# Altium schematic sheet camera.SchDoc
size A3
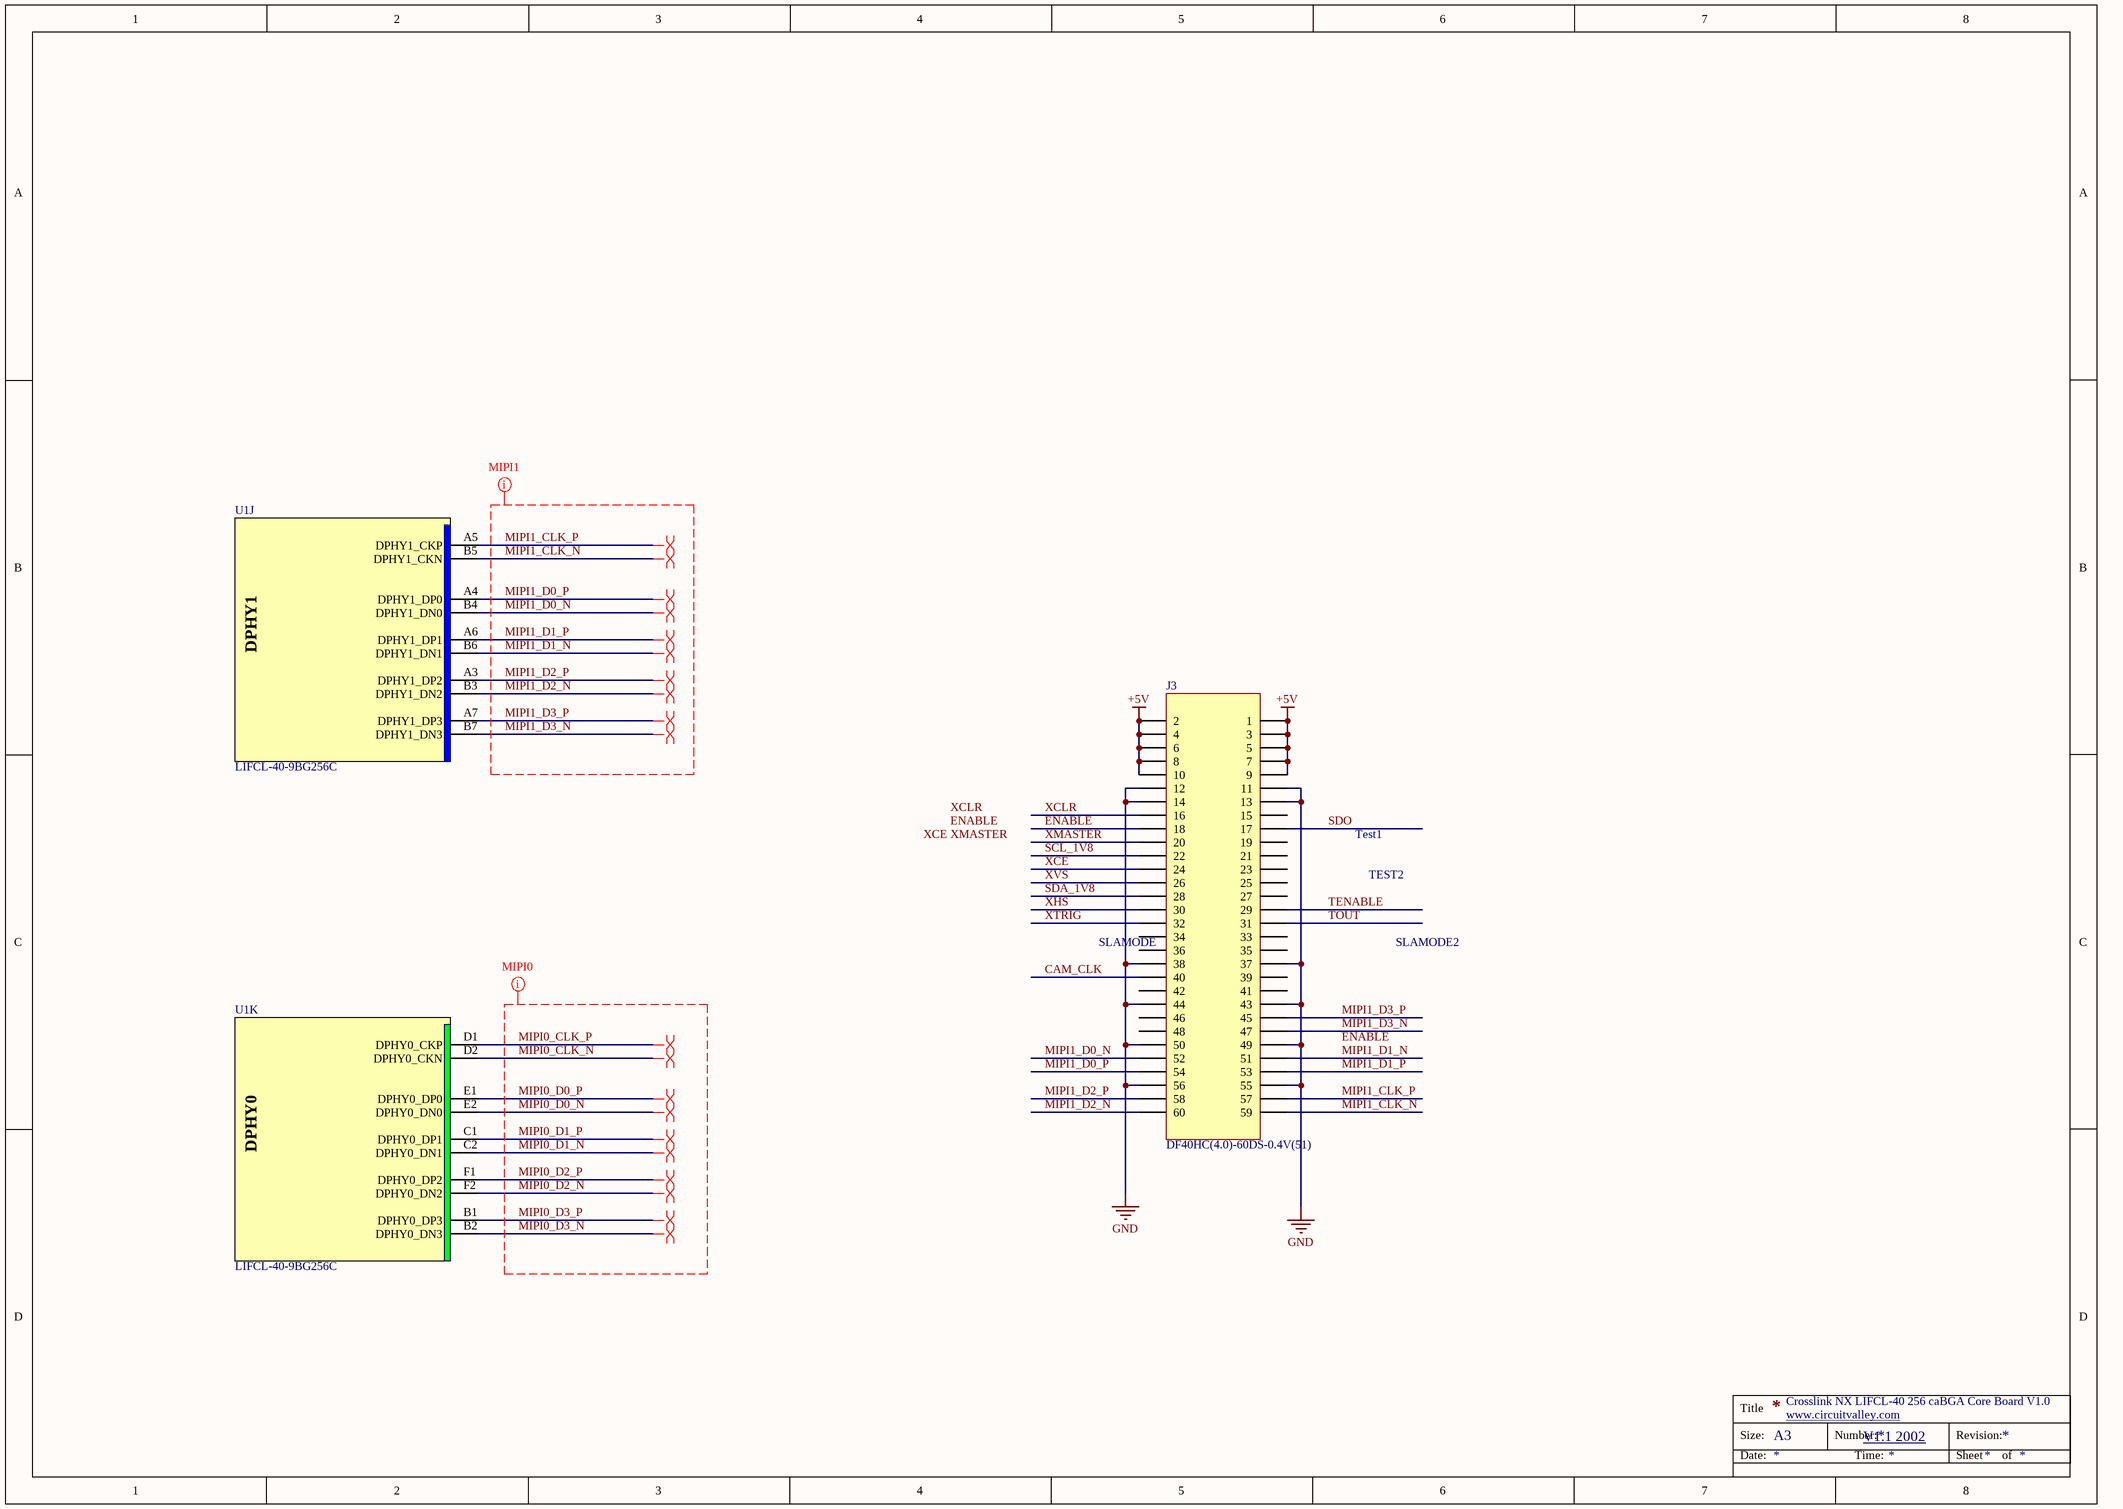
[diagram p0: camera.SchDoc]

## Parts
J3  DF40HC(4.0)-60DS-0.4V(51)  [DF40HC(4.0)-60DS-0.4V(51)]
U1  LIFCL-40-9BG256C  [Lattice_256_CABGA]  (parts J,K of 14)

## Nets
+5V: J3.1 J3.2 J3.3 J3.4 J3.5 J3.6 J3.7 J3.8 J3.9 J3.10
GND: J3.11 J3.12 J3.13 J3.14 J3.37 J3.38 J3.43 J3.44 J3.49 J3.50 J3.55 J3.56
CAM_CLK: J3.40
ENABLE: J3.18
MIPI0_CLK_N: U1.D2(DPHY0_CKN)
MIPI0_CLK_P: U1.D1(DPHY0_CKP)
MIPI0_D0_N: U1.E2(DPHY0_DN0)
MIPI0_D0_P: U1.E1(DPHY0_DP0)
MIPI0_D1_N: U1.C2(DPHY0_DN1)
MIPI0_D1_P: U1.C1(DPHY0_DP1)
MIPI0_D2_N: U1.F2(DPHY0_DN2)
MIPI0_D2_P: U1.F1(DPHY0_DP2)
MIPI0_D3_N: U1.B2(DPHY0_DN3)
MIPI0_D3_P: U1.B1(DPHY0_DP3)
MIPI1_CLK_N: J3.59 U1.B5(DPHY1_CKN)
MIPI1_CLK_P: J3.57 U1.A5(DPHY1_CKP)
MIPI1_D0_N: J3.52 U1.B4(DPHY1_DN0)
MIPI1_D0_P: J3.54 U1.A4(DPHY1_DP0)
MIPI1_D1_N: J3.51 U1.B6(DPHY1_DN1)
MIPI1_D1_P: J3.53 U1.A6(DPHY1_DP1)
MIPI1_D2_N: J3.60 U1.B3(DPHY1_DN2)
MIPI1_D2_P: J3.58 U1.A3(DPHY1_DP2)
MIPI1_D3_N: J3.47 U1.B7(DPHY1_DN3)
MIPI1_D3_P: J3.45 U1.A7(DPHY1_DP3)
SCL_1V8: J3.22
SDA_1V8: J3.28
SDO: J3.17
TENABLE: J3.29
TOUT: J3.31
XCE: J3.24
XCLR: J3.16
XHS: J3.30
XMASTER: J3.20
XTRIG: J3.32
XVS: J3.26

Not connected (* = marked no-connect by the designer): J3 15 19 21 23 25 27 33 34 35 36 39 41 42 46 48

## Layout directives
differential pair: MIPI0_CLK_N, MIPI0_CLK_P, MIPI0_D0_N, MIPI0_D0_P, MIPI0_D1_N, MIPI0_D1_P, MIPI0_D2_N, MIPI0_D2_P, MIPI0_D3_N, MIPI0_D3_P, MIPI1_CLK_N, MIPI1_CLK_P, MIPI1_D0_N, MIPI1_D0_P, MIPI1_D1_N, MIPI1_D1_P, MIPI1_D2_N, MIPI1_D2_P, MIPI1_D3_N, MIPI1_D3_P
net class MIPI0: MIPI0_CLK_N, MIPI0_CLK_P, MIPI0_D0_N, MIPI0_D0_P, MIPI0_D1_N, MIPI0_D1_P, MIPI0_D2_N, MIPI0_D2_P, MIPI0_D3_N, MIPI0_D3_P
net class MIPI1: MIPI1_CLK_N, MIPI1_CLK_P, MIPI1_D0_N, MIPI1_D0_P, MIPI1_D1_N, MIPI1_D1_P, MIPI1_D2_N, MIPI1_D2_P, MIPI1_D3_N, MIPI1_D3_P

## Notes on the sheet
- Test1
- TEST2
- SLAMODE
- SLAMODE2
- Crosslink NX LIFCL-40 256 caBGA Core Board V1.0
- www.circuitvalley.com <http://www.circuitvalley.com>
- V1.1 2002
- Labels drawn without touching a wire or pin: ENABLE, XCE, XCLR, XMASTER
- Title
- Size:
- Date:
- A3
- Number:
- Time:
- Revision:
- Sheet
- of
- (in symbol LIFCL-40-9BG256C, part J) DPHY1
- (in symbol LIFCL-40-9BG256C, part K) DPHY0

## Library data of the parts
J3 = DF40HC(4.0)-60DS-0.4V(51): Hiros 60 pin Connector
U1 = LIFCL-40-9BG256C: FPGA CorsslinkNX  LIFCL-40-9BG256C